# Altium project Flight_Controller.PrjPcb
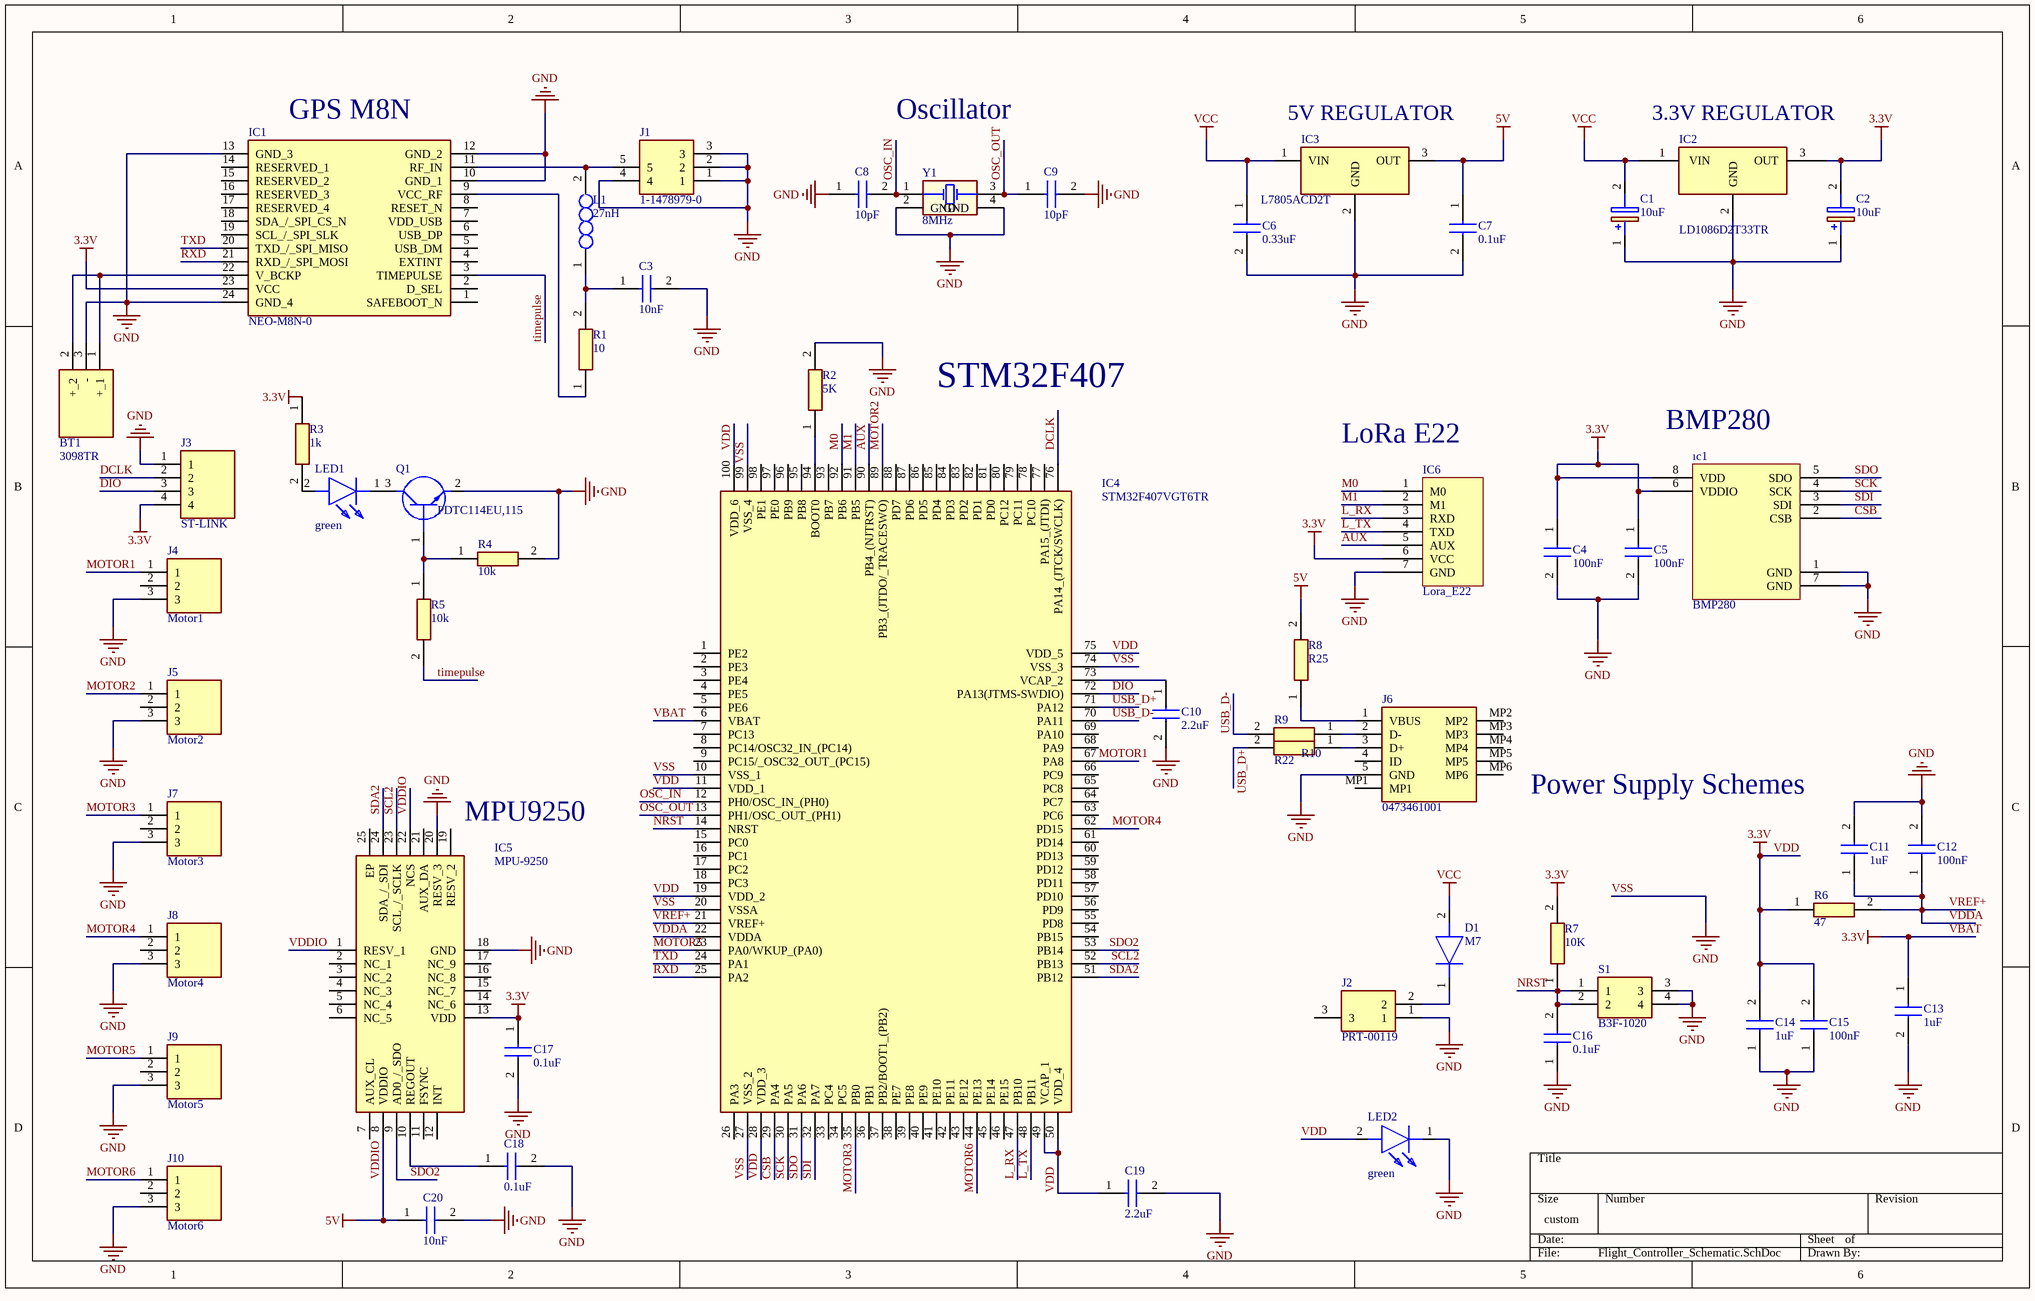
[diagram p0: Flight_Controller_Schematic.SchDoc]
1 sheet, 55 parts. Net scope: global (net labels, ports and power ports of the same name join across sheets).
Board file: Flight_Controller_PCB.PcbDoc

## Sheet Flight_Controller_Schematic.SchDoc
size 381 x 241 mm; SheetNumber: 1; SheetTotal: 1

### Parts
(Parts that share a designator on the sheet are numbered #1, #2 ... from top to bottom, then left to right.)
BT1  3098TR  [3098TR]
C1  10uF  [CAPPM168X90N]
C2  10uF  [CAPPM168X90N]
C3  10nF  [C1206]
C4  100nF  [C1206]
C5  100nF  [C1206]
C6  0.33uF  [C1206]
C7  0.1uF  [C1206]
C8  10pF  [C1206]
C9  10pF  [C1206]
C10  2.2uF  [C1206]
C11  1uF  [C1206]
C12  100nF  [C1206]
C13  1uF  [C1206]
C14  1uF  [C1206]
C15  100nF  [C1206]
C16  0.1uF  [C1206]
C17  0.1uF  [C1206]
C18  0.1uF  [C1206]
C19  2.2uF  [C1206]
C20  10nF  [C1206]
D1  M7  [DIOM5626X245N]
IC1#1  NEO-M8N-0  [NEO-M8T]
IC2  LD1086D2T33TR  [TS78M05CP]
IC3  L7805ACD2T  [STB20N95K5]
IC4  STM32F407VGT6TR  [QFP50P1600X1600X160-100N]
IC5  MPU-9250  [QFN40P300X300X105-25N-D]
IC6  Lora_E22  [Lora_E22]
J1  1-1478979-0  [114789790]
J2  PRT-00119  [PRT00119]
J3  ST-LINK  [HDRRA4W67P0X254_1X4_1016X254X241P]
J4  Motor1  [HDRV3W66P0X254_1X3_737X250X890P]
J5  Motor2  [HDRV3W66P0X254_1X3_737X250X890P]
J6  0473461001  [0473461001]
J7  Motor3  [HDRV3W66P0X254_1X3_737X250X890P]
J8  Motor4  [HDRV3W66P0X254_1X3_737X250X890P]
J9  Motor5  [HDRV3W66P0X254_1X3_737X250X890P]
J10  Motor6  [HDRV3W66P0X254_1X3_737X250X890P]
L1  27nH  [WE-KI_0402A30]
LED1  green  [150040BS73220]
LED2  green  [150040BS73220]
Q1  PDTC114EU,115  [PDTC114EU115]
R1  10  [RESC1608X55N]
R2  5K  [RESC1608X55N]
R3  1k  [RESC1608X55N]
R4  10k  [RESC1608X55N]
R5  10k  [RESC1608X55N]
R6  47  [RESC1608X55N]
R7  10K  [RESC1608X55N]
R8  R25  [RESC1608X55N]
R9  R22  [RESC1608X55N]
R10  R22  [RESC1608X55N]
S1  B3F-1020  [B3F1000]
Y1  8MHz  [8MHz 12.5pF Osc]
ıc1#2  BMP280  [BMP280]

### Nets
VBAT: C2.2(-) C4.1 C5.1 C13.1 C14.2 C15.2 C17.1 C19.1 IC1#1.23(VCC) IC2.3(OUT) IC4.6(VBAT) IC4.11(VDD_1) IC4.19(VDD_2) IC4.28(VDD_3) IC4.49(VCAP_1) IC4.50(VDD_4) IC4.75(VDD_5) IC4.100(VDD_6) IC5.13(VDD) IC6.6(VCC) J3.4 LED2.2(A) R3.1 R6.1 R7.2 ıc1#2.6(VDDIO) ıc1#2.8(VDD)  [also labelled 3.3V, VDD]
VCC: C1.2(-) C6.1 D1.2(A) IC2.1(VIN) IC3.1(VIN)
VDDIO: C7.1 C20.1 IC3.3(OUT) IC5.1(RESV_1) IC5.8(VDDIO) IC5.22(NCS) R8.2  [also labelled 5V]
VSS: BT1.3(-) C1.1(+) C2.1(+) C3.2 C4.2 C5.2 C6.2 C7.2 C8.1 C9.2 C10.2 C11.2 C12.2 C13.2 C14.1 C15.1 C16.1 C17.2 C18.2 C19.2 C20.2 IC1#1.10(GND_1) IC1#1.12(GND_2) IC1#1.13(GND_3) IC1#1.24(GND_4) IC2.2(GND) IC3.2(GND) IC4.10(VSS_1) IC4.20(VSSA) IC4.27(VSS_2) IC4.74(VSS_3) IC4.99(VSS_4) IC5.18(GND) IC5.20(RESV_3) IC6.7(GND) J1.1 J1.2 J1.3 J1.4 J2.1 J3.1 J4.3 J5.3 J6.5(GND) J7.3 J8.3 J9.3 J10.3 LED2.1(K) Q1.2(E) R2.2 R4.2 S1.3 S1.4 Y1.2(GND) Y1.4(GND) ıc1#2.1(GND) ıc1#2.7(GND)  [also labelled GND]
AUX: IC4.90(PB4_(NJTRST)) IC6.5(AUX)
CSB: IC4.29(PA4) ıc1#2.2(CSB)
DCLK: IC4.76(PA14_(JTCK/SWCLK)) J3.2
DIO: IC4.72(PA13(JTMS-SWDIO)) J3.3
L_RX: IC4.47(PB10) IC6.3(RXD)
L_TX: IC4.48(PB11) IC6.4(TXD)
M0: IC4.92(PB6) IC6.1(M0)
M1: IC4.91(PB5) IC6.2(M1)
MOTOR1: IC4.67(PA8) J4.1
MOTOR2: IC4.89(PB3_(JTDO/_TRACESWO)) J5.1
MOTOR3: IC4.35(PB0) J7.1
MOTOR4: IC4.62(PD15) J8.1
MOTOR5: IC4.23(PA0/WKUP_(PA0)) J9.1
MOTOR6: IC4.44(PE13) J10.1
NRST: C16.2 IC4.14(NRST) R7.1 S1.1 S1.2
OSC_IN: C8.2 IC4.12(PH0/OSC_IN_(PH0)) Y1.1
OSC_OUT: C9.1 IC4.13(PH1/OSC_OUT_(PH1)) Y1.3
RXD: IC1#1.21(RXD_/_SPI_MOSI) IC4.25(PA2)
SCK: IC4.30(PA5) ıc1#2.4(SCK)
SCL2: IC4.52(PB13) IC5.23(SCL_/_SCLK)
SDA2: IC4.51(PB12) IC5.24(SDA_/_SDI)
SDI: IC4.32(PA7) ıc1#2.3(SDI)
SDO: IC4.31(PA6) ıc1#2.5(SDO)
SDO2: IC4.53(PB14) IC5.9(AD0_/_SDO)
timepulse: IC1#1.3(TIMEPULSE) R5.2
TXD: IC1#1.20(TXD_/_SPI_MISO) IC4.24(PA1)
USB_D+: IC4.71(PA12) R10.2
USB_D-: IC4.70(PA11) R9.2
VDDA: C11.1 C12.1 IC4.21(VREF+) IC4.22(VDDA) R6.2  [also labelled VREF+]
NetBT1_1: BT1.1(+_1) BT1.2(+_2) IC1#1.22(V_BCKP)
NetC3_1: C3.1 L1.1 R1.2
NetC10_1: C10.1 IC4.73(VCAP_2)
NetC18_1: C18.1 IC5.10(REGOUT)
NetD1_1: D1.1(K) J2.2
NetIC1#1_9: IC1#1.9(VCC_RF) R1.1
NetIC1#1_11: IC1#1.11(RF_IN) J1.5 L1.2
NetIC4_94: IC4.94(BOOT0) R2.1
NetJ6_1: J6.1(VBUS) R8.1
NetJ6_2: J6.2(D-) R9.1
NetJ6_3: J6.3(D+) R10.1
NetLED1_1: LED1.1(K) Q1.3(C)
NetLED1_2: LED1.2(A) R3.2
NetQ1_1: Q1.1(B) R4.1 R5.1

Not connected (* = marked no-connect by the designer): IC1#1 1(SAFEBOOT_N) 2(D_SEL) 4(EXTINT) 5(USB_DM) 6(USB_DP) 7(VDD_USB) 8(RESET_N) 14(RESERVED_1) 15(RESERVED_2) 16(RESERVED_3) 17(RESERVED_4) 18(SDA_/_SPI_CS_N) 19(SCL_/_SPI_SLK); IC4 1(PE2) 2(PE3) 3(PE4) 4(PE5) 5(PE6) 7(PC13) 8(PC14/OSC32_IN_(PC14)) 9(PC15/_OSC32_OUT_(PC15)) 15(PC0) 16(PC1) 17(PC2) 18(PC3) 26(PA3) 33(PC4) 34(PC5) 36(PB1) 37(PB2/BOOT1_(PB2)) 38(PE7) 39(PE8) 40(PE9) 41(PE10) 42(PE11) 43(PE12) 45(PE14) 46(PE15) 54(PB15) 55(PD8) 56(PD9) 57(PD10) 58(PD11) 59(PD12) 60(PD13) 61(PD14) 63(PC6) 64(PC7) 65(PC8) 66(PC9) 68(PA9) 69(PA10) 77(PA15_(JTDI)) 78(PC10) 79(PC11) 80(PC12) 81(PD0) 82(PD1) 83(PD2) 84(PD3) 85(PD4) 86(PD5) 87(PD6) 88(PD7) 93(PB7) 95(PB8) 96(PB9) 97(PE0) 98(PE1); IC5 2(NC_1) 3(NC_2) 4(NC_3) 5(NC_4) 6(NC_5) 7(AUX_CL) 11(FSYNC) 12(INT) 14(NC_6) 15(NC_7) 16(NC_8) 17(NC_9) 19(RESV_2) 21(AUX_DA) 25(EP); J2 3; J4 2; J5 2; J6 4(ID) MP1 MP2 MP3 MP4 MP5 MP6; J7 2; J8 2; J9 2; J10 2

### Notes on the sheet
- (near IC1#1) GPS M8N
- Oscillator
- (near IC3) 5V REGULATOR
- (near IC2) 3.3V REGULATOR
- STM32F407
- (near ıc1#2) BMP280
- (near IC6) LoRa E22
- (near IC5) MPU9250
- Power Supply Schemes

### Library data of the parts
BT1 = 3098TR: Battery; Manufacturer_Name: Keystone Electronics; Datasheet Link: https://www.keyelco.com/product-pdf.cfm?p=3958; Height: 3.05mm; Manufacturer_Part_Number: 3098TR; Mouser Part Number: 534-3098TR; Mouser Price/Stock: https://www.mouser.co.uk/ProductDetail/Keystone-Electronics/3098TR?qs=BMR1h6ig6pBw2SwGeQy5sw%3D%3D
C1 C2 = TR8M106M010C2000: Capacitor Polarised; Manufacturer_Name: Vishay; Datasheet Link: https://www.vishay.com/docs/40114/tr8.pdf; Height: 0.9mm; Manufacturer_Part_Number: TR8M106M010C2000; Mouser Part Number: 74-TR8M106M010C2000; Mouser Price/Stock: https://www.mouser.co.uk/ProductDetail/Vishay-Sprague/TR8M106M010C2000/?qs=A6MsUmktA0wQ2FaijS70cA%3D%3D; Arrow Part Number: TR8M106M010C2000; Arrow Price/Stock: https://www.arrow.com/en/products/tr8m106m010c2000/vishay
C3-C20 = C1206C104K5RALTU: Capacitor; Manufacturer_Name: KEMET; Datasheet Link: https://content.kemet.com/datasheets/KEM_C1018_X7R_SnPb_SMD.pdf; Manufacturer_Part_Number: C1206C104K5RALTU; Mouser Part Number: 80-C1206C104K5RAL; Mouser Price/Stock: https://www.mouser.co.uk/ProductDetail/KEMET/C1206C104K5RALTU?qs=8Ej%2FxtLsO2lb2phBuiebIQ%3D%3D; Arrow Part Number: C1206C104K5RALTU; Arrow Price/Stock: https://www.arrow.com/en/products/c1206c104k5raltu/kemet-corporation?region=nac
D1 = M7: Diode; Manufacturer_Name: LGE; Datasheet Link: https://datasheet.lcsc.com/szlcsc/LGE-M7-SMAJ_C330214.pdf; Height: 2.45mm; Manufacturer_Part_Number: M7
IC1#1 = NEO-M8N-0: Integrated Circuit; Manufacturer_Name: U-Blox; Datasheet Link: https://www.u-blox.com/sites/default/files/NEO-M8-FW3_DataSheet_%28UBX-15031086%29.pdf; Manufacturer_Part_Number: NEO-M8N-0; Mouser Part Number: 377-NEO-M8N-0; Mouser Price/Stock: https://www.mouser.co.uk/ProductDetail/u-blox/NEO-M8N-0?qs=zW32dvEIR3unZhZI0KRbew%3D%3D
IC2 = LD1086D2T33TR: Integrated Circuit; Manufacturer_Name: STMicroelectronics; Datasheet Link: http://www.st.com/web/en/resource/technical/document/datasheet/CD00001884.pdf; Height: 4.6mm; Manufacturer_Part_Number: LD1086D2T33TR; Mouser Part Number: 511-LD1086D2T33-TR; Mouser Price/Stock: https://www.mouser.co.uk/ProductDetail/STMicroelectronics/LD1086D2T33TR?qs=NVtqiPcHxP%2FqlwvBP9ORAw%3D%3D; Arrow Part Number: LD1086D2T33TR; Arrow Price/Stock: https://www.arrow.com/en/products/ld1086d2t33tr/stmicroelectronics?region=europe
IC3 = L7805ACD2T: Integrated Circuit; Manufacturer_Name: STMicroelectronics; Datasheet Link: https://componentsearchengine.com/Datasheets/1/L7805ACD2T.pdf; Height: 4mm; Manufacturer_Part_Number: L7805ACD2T; Mouser Part Number: 511-L7805ACD2T; Mouser Price/Stock: https://www.mouser.co.uk/ProductDetail/STMicroelectronics/L7805ACD2T?qs=f9uBznyCLhZ5tRIsM0TDkA%3D%3D
IC4 = STM32F407VGT6TR: Integrated Circuit; Manufacturer_Name: STMicroelectronics; Datasheet Link: https://www.st.com/resource/en/datasheet/stm32f407vg.pdf; Height: 1.6mm; Manufacturer_Part_Number: STM32F407VGT6TR; Mouser Part Number: 511-STM32F407VGT6TR; Mouser Price/Stock: https://www.mouser.co.uk/ProductDetail/STMicroelectronics/STM32F407VGT6TR?qs=gNDSiZmRJS%2Fm459dFMQZBA%3D%3D; Arrow Part Number: STM32F407VGT6TR; Arrow Price/Stock: https://www.arrow.com/en/products/stm32f407vgt6tr/stmicroelectronics?region=nac
IC5 = MPU-9250: Integrated Circuit; Manufacturer_Name: TDK; Datasheet Link: https://media.digikey.com/pdf/Data%20Sheets/TDK%20PDFs/MPU-9250_Rev_1.1.pdf; Height: 1.05mm; Manufacturer_Part_Number: MPU-9250; Mouser Part Number: 410-MPU-9250; Mouser Price/Stock: https://www.mouser.co.uk/ProductDetail/TDK-InvenSense/MPU-9250?qs=u4fy%2FsgLU9OhGjFkQSZssA%3D%3D
J1 = 1-1478979-0: Connector; Manufacturer_Name: TE Connectivity; Datasheet Link: http://www.te.com/commerce/DocumentDelivery/DDEController?Action=showdoc&DocId=Customer+Drawing%7F1478979%7FB%7Fpdf%7FEnglish%7FENG_CD_1478979_B.pdf%7F1-1478979-0; Manufacturer_Part_Number: 1-1478979-0; Mouser Part Number: 571-1-1478979-0; Mouser Price/Stock: https://www.mouser.co.uk/ProductDetail/TE-Connectivity/1-1478979-0?qs=Vcr9%2FL0R50jLfIYfi0kfuw%3D%3D; Arrow Part Number: 1-1478979-0; Arrow Price/Stock: https://www.arrow.com/en/products/1-1478979-0/te-connectivity?region=europe
J2 = PRT-00119: Connector; Manufacturer_Name: SparkFun; Datasheet Link: https://www.sparkfun.com/datasheets/Prototyping/Barrel-Connector-PJ-202A.pdf; Height: 11mm; Manufacturer_Part_Number: PRT-00119; Mouser Part Number: 474-PRT-00119; Mouser Price/Stock: https://www.mouser.co.uk/ProductDetail/SparkFun/PRT-00119?qs=WyAARYrbSnbnQpS9xf%252Bx5A%3D%3D; Arrow Part Number: PRT-00119; Arrow Price/Stock: https://www.arrow.com/en/products/prt-00119/sparkfun-electronics?region=nac
J3 = 10129379-904002BLF: Connector; Manufacturer_Name: Amphenol Communications Solutions; Datasheet Link: https://cdn.amphenol-cs.com/media/wysiwyg/files/drawing/10129379.pdf; Height: 2.41mm; Manufacturer_Part_Number: 10129379-904002BLF; Mouser Part Number: 649-1012937990402BLF; Mouser Price/Stock: https://www.mouser.co.uk/ProductDetail/Amphenol-FCI/10129379-904002BLF?qs=0lQeLiL1qybYsOE3kPCMFA%3D%3D
J4 J5 J7-J10 = 210-91-03GB01: Connector; Manufacturer_Name: PINREX; Datasheet Link: https://datasheet.lcsc.com/lcsc/1912111437_PINREX-210-91-03GB01_C390679.pdf; Height: 8.9mm; Manufacturer_Part_Number: 210-91-03GB01
J6 = 0473461001: Connector; Manufacturer_Name: Molex; Datasheet Link: https://componentsearchengine.com/Datasheets/1/0473461001.pdf; Height: 2.45mm; Manufacturer_Part_Number: 0473461001; Mouser Part Number: N/A; Mouser Price/Stock: https://www.mouser.co.uk/ProductDetail/Molex/0473461001?qs=2bnkQPT%252BPafTZgGVt%2FOGfA%3D%3D; Arrow Part Number: 0473461001; Arrow Price/Stock: https://www.arrow.com/en/products/0473461001/molex?region=nac
L1 = 744765119A: Inductor; Manufacturer_Name: Wurth Elektronik; Manufacturer_Part_Number: 744765119A; Mouser Part Number: 710-744765119A; Mouser Price/Stock: https://www.mouser.co.uk/ProductDetail/Wurth-Elektronik/744765119A?qs=MVRUG6Lt7nGGidQwVT5k2g%3D%3D
LED1 LED2 = 150040BS73220: LED; Manufacturer_Name: Wurth Elektronik; Datasheet Link: https://componentsearchengine.com/Datasheets/1/150040BS73220.pdf; Height: 0.35mm; Manufacturer_Part_Number: 150040BS73220; Mouser Part Number: 710-150040BS73220; Mouser Price/Stock: https://www.mouser.co.uk/ProductDetail/Wurth-Elektronik/150040BS73220?qs=u16ybLDytRa6gY6jG0El6g%3D%3D
Q1 = PDTC114EU,115: Transistor BJT NPN; Manufacturer_Name: Nexperia; Datasheet Link: https://assets.nexperia.com/documents/data-sheet/PDTC114E_SER.pdf; Height: 1.1mm; Manufacturer_Part_Number: PDTC114EU,115; Mouser Part Number: 771-PDTC114EU115; Mouser Price/Stock: https://www.mouser.co.uk/ProductDetail/Nexperia/PDTC114EU115?qs=LOCUfHb8d9s6AnIpL5ILEg%3D%3D; Arrow Part Number: PDTC114EU,115; Arrow Price/Stock: https://www.arrow.com/en/products/pdtc114eu115/nexperia?region=europe
R1-R10 = ERJ-3EKF1001V: Resistor; Manufacturer_Name: Panasonic; Datasheet Link: http://industrial.panasonic.com/cdbs/www-data/pdf/RDA0000/AOA0000C86.pdf; Height: 0.55mm; Manufacturer_Part_Number: ERJ-3EKF1001V; Mouser Part Number: 667-ERJ-3EKF1001V; Mouser Price/Stock: https://www.mouser.co.uk/ProductDetail/Panasonic/ERJ-3EKF1001V?qs=H7k1u0Mp9JTM8yQxOuvoDg%3D%3D; Arrow Part Number: ERJ-3EKF1001V; Arrow Price/Stock: https://www.arrow.com/en/products/erj-3ekf1001v/panasonic?region=europe
S1 = B3F-1020: Switch; Manufacturer_Name: Omron Electronics; Datasheet Link: http://www.omron.com/ecb/products/pdf/en-b3f.pdf; Manufacturer_Part_Number: B3F-1020; Mouser Part Number: 653-B3F-1020; Mouser Price/Stock: https://www.mouser.co.uk/ProductDetail/Omron-Electronics/B3F-1020?qs=lK7M36XCk6J1%2FfWxwEHrqA%3D%3D; Arrow Part Number: B3F-1020; Arrow Price/Stock: https://www.arrow.com/en/products/b3f-1020/omron?region=europe
Y1 = 8MHz 12.5pF Osc